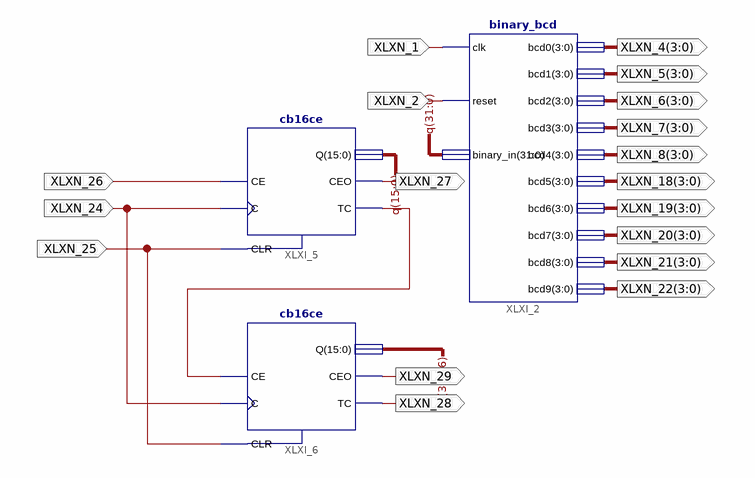
[diagram p0: schematic sheet 1]
// Xilinx ISE schematic top.sch (spartan3e) as structural Verilog: 3 symbols, 18 ports
module top (
  input  XLXN_1,
  input  XLXN_2,
  input  XLXN_24,
  input  XLXN_25,
  input  XLXN_26,
  output [3:0] XLXN_4,
  output [3:0] XLXN_5,
  output [3:0] XLXN_6,
  output [3:0] XLXN_7,
  output [3:0] XLXN_8,
  output [3:0] XLXN_18,
  output [3:0] XLXN_19,
  output [3:0] XLXN_20,
  output [3:0] XLXN_21,
  output [3:0] XLXN_22,
  output XLXN_27,
  output XLXN_28,
  output XLXN_29
);

  wire XLXN_23;
  wire [31:0] q;

  binary_bcd XLXI_2 (
    .clk(XLXN_1), .reset(XLXN_2), .binary_in(q), .bcd0(XLXN_4), .bcd1(XLXN_5), .bcd2(XLXN_6), .bcd3(XLXN_7),
    .bcd4(XLXN_8), .bcd5(XLXN_18), .bcd6(XLXN_19), .bcd7(XLXN_20), .bcd8(XLXN_21), .bcd9(XLXN_22));
  cb16ce XLXI_5 (.C(XLXN_24), .CE(XLXN_26), .CLR(XLXN_25), .CEO(XLXN_27), .Q(q[15:0]), .TC(XLXN_23));
  cb16ce XLXI_6 (.C(XLXN_24), .CE(XLXN_23), .CLR(XLXN_25), .CEO(XLXN_29), .Q(q[31:16]), .TC(XLXN_28));
endmodule
